# EAGLE design working (EAGLE 8.6.0)
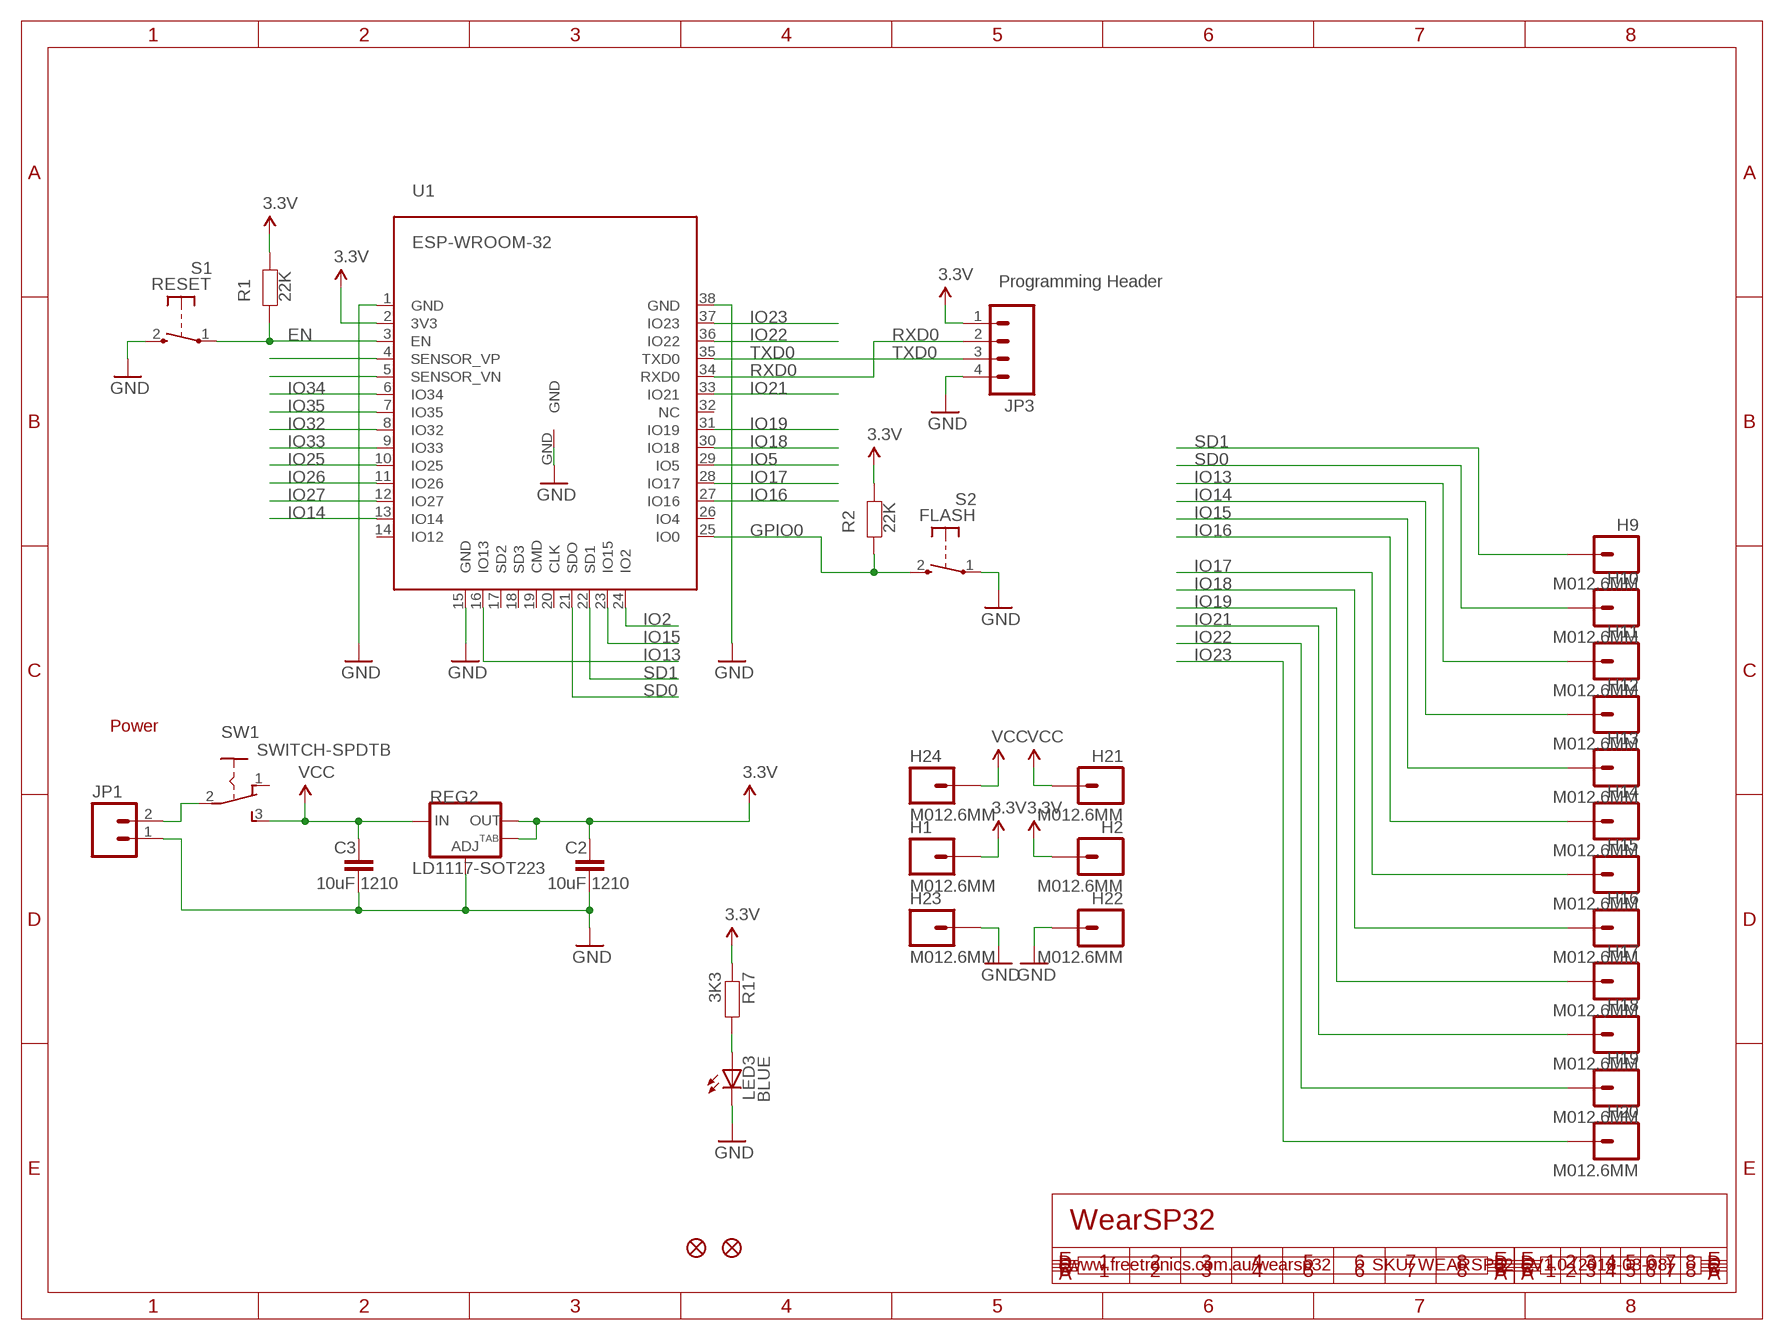
[diagram p0: schematic, sheet 1]

## Parts
C2  10uF 1210  C-EUC1210  [C1210]
C3  10uF 1210  C-EUC1210  [C1210]
H1  M012.6MM  [1X01_2_6MM]
H2  M012.6MM  [1X01_2_6MM]
H9  M012.6MM  [1X01_2_6MM]
H10  M012.6MM  [1X01_2_6MM]
H11  M012.6MM  [1X01_2_6MM]
H12  M012.6MM  [1X01_2_6MM]
H13  M012.6MM  [1X01_2_6MM]
H14  M012.6MM  [1X01_2_6MM]
H15  M012.6MM  [1X01_2_6MM]
H16  M012.6MM  [1X01_2_6MM]
H17  M012.6MM  [1X01_2_6MM]
H18  M012.6MM  [1X01_2_6MM]
H19  M012.6MM  [1X01_2_6MM]
H20  M012.6MM  [1X01_2_6MM]
H21  M012.6MM  [1X01_2_6MM]
H22  M012.6MM  [1X01_2_6MM]
H23  M012.6MM  [1X01_2_6MM]
H24  M012.6MM  [1X01_2_6MM]
JP1  M02JST-PTH-2  [JST-2-PTH]
JP3  M04PTH  [1X04]
LED3  BLUE  LED0603  [LED-0603]
R1  22K  RESISTOR0603  [0603@2]
R2  22K  RESISTOR0603  [0603@2]
R17  3K3  RESISTOR0603  [0603]
REG2  LD1117-SOT223  V_REG_LM1117SOT223  [SOT223]
S1  RESET  TAC_SWITCH_2PIN  [TACTILE_SWITCH_SMD_2PIN_TINY]
S2  FLASH  TAC_SWITCH_2PIN  [TACTILE_SWITCH_SMD_2PIN_TINY]
SW1  SWITCH-SPDTB  [SPDT-2.5MM]
U1  ESP-WROOM-32  [ESP-WROOM-32]
U$4  FIDUCIAL1X2.5  [FIDUCIAL-1X2.5]
U$5  FIDUCIAL1X2.5  [FIDUCIAL-1X2.5]

## Nets
3.3V: C2.1 H1.1 H2.1 JP3.1 R1.1 R2.1 R17.1 REG2.2(OUT) REG2.4(OUT) U1.2(3V3)
EN: R1.2 S1.1(P) U1.3(EN)
GND: C2.2 C3.2 H22.1 H23.1 JP1.1 JP3.4 LED3.C REG2.1(ADJ) S1.2(S) S2.1(P) U1.1(GND) U1.15(GND) U1.38(GND) U1.GND
GPIO0: R2.2 S2.2(S) U1.25(IO0)
IO2: U1.24(IO2)
IO5: U1.29(IO5)
IO13: H11.1 U1.16(IO13)
IO14: H12.1 U1.13(IO14)
IO15: H13.1 U1.23(IO15)
IO16: H14.1 U1.27(IO16)
IO17: H15.1 U1.28(IO17)
IO18: H16.1 U1.30(IO18)
IO19: H17.1 U1.31(IO19)
IO21: H18.1 U1.33(IO21)
IO22: H19.1 U1.36(IO22)
IO23: H20.1 U1.37(IO23)
IO25: U1.10(IO25)
IO26: U1.11(IO26)
IO27: U1.12(IO27)
IO32: U1.8(IO32)
IO33: U1.9(IO33)
IO34: U1.6(IO34)
IO35: U1.7(IO35)
N$1: LED3.A R17.2
N$2: JP1.2 SW1.2
N$20: U1.4(SENSOR_VP)
N$21: U1.5(SENSOR_VN)
RXD0: JP3.2 U1.34(RXD0)
SD0: H10.1 U1.21(SDO)
SD1: H9.1 U1.22(SD1)
TXD0: JP3.3 U1.35(TXD0)
VCC: C3.1 H21.1 H24.1 REG2.3(IN) SW1.3
Unconnected: SW1.1 U1.14(IO12) U1.17(SD2) U1.18(SD3) U1.19(CMD) U1.20(CLK) U1.26(IO4) U1.32(NC)

## Notes on the sheet
- Programming Header
- Power
- WearSP32
- www.freetronics.com.au/wearsp32 | SKU: WEARSP32 | V1.0 (2018-03-08)

## Library data of the parts
C2 C3 = freetronics-jon:C-EU: CAPACITOR, European symbol
H1 H2 H9-H24 = freetronics-jon:M01: Header 1 Standard 1-pin 0.1" header. Use with straight break away headers (SKU : PRT-00116), right angle break away headers (PRT-00553), swiss pins (PRT-00743), machine pins (PRT-00117), and female headers (PRT-00115).
JP1 = freetronics-jon:M02: Header 2 Standard 2-pin 0.1" header. Use with straight break away headers (SKU : PRT-00116), right angle break away headers (PRT-00553), swiss pins (PRT-00743), machine pins (PRT-00117), and female headers (PRT-00115). Molex polarized connector foot print use with SKU : PRT-08233 with associated crimp pins and housings.
JP3 = freetronics-jon:M04: Header 4 Standard 4-pin 0.1" header. Use with straight break away headers (SKU : PRT-00116), right angle break away headers (PRT-00553), swiss pins (PRT-00743), machine pins (PRT-00117), and female headers (PRT-00115). Molex polarized connector foot print use with SKU : PRT-08231 with associated crimp pins and housings. 1MM SMD Version SKU: PRT-10208
LED3 = freetronics-jon:LED: LEDs Standard schematic elements and footprints for 5mm, 3mm, 1206, and 0603 sized LEDs. 5mm - Spark Fun Electronics SKU : COM-00529 (and others)
R1 R2 = freetronics:RESISTOR: Resistor Basic schematic elements and footprints for 0603, 1206, and PTH 1/10th watt (small) resistors.
R17 = freetronics-jon:RESISTOR: Resistor Basic schematic elements and footprints for 0603, 1206, and PTH 1/10th watt (small) resistors.
REG2 = freetronics:V_REG_LM1117: Voltage Regulator LD1117 Adjustable low-dropout voltage regulator available in SOT89 and SOT223 SMT packages.
S1 S2 = freetronics-jon:TAC_SWITCH_2PIN: Momentary Tactile Switch - 2 pin
SW1 = freetronics-jon:SWITCH-SPDT
U1 = esp32:ESP-WROOM-32
U$4 U$5 = freetronics-original:FIDUCIAL: Fiducial Alignment Points Various fiducial points for machine vision alignment.

## Net classes
1 VCC: width 0.305 mm

## Board
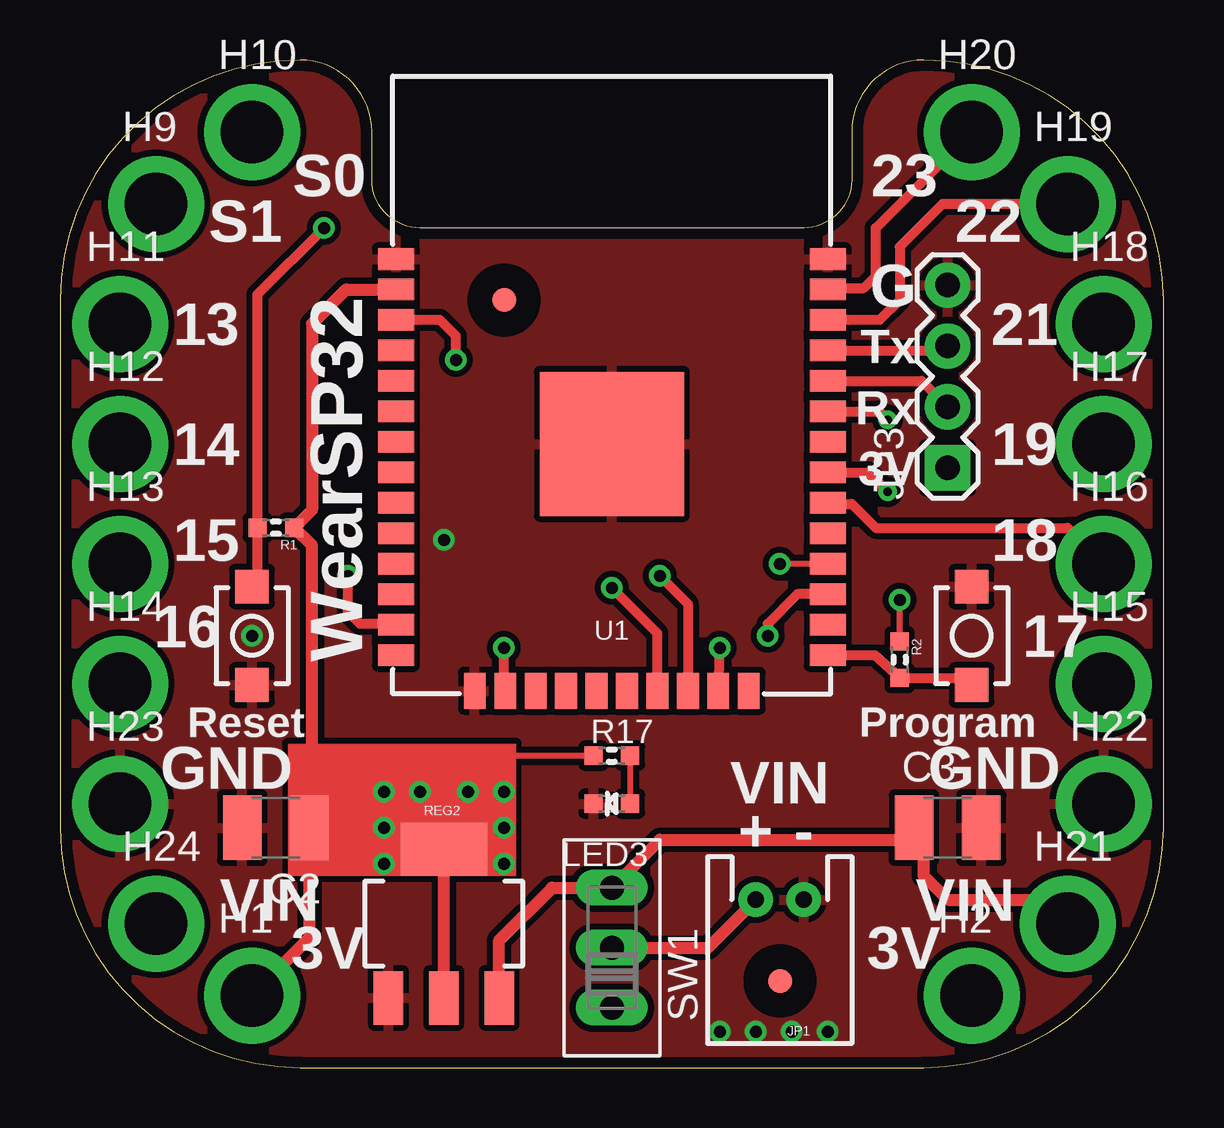
[diagram p1: board, top side]
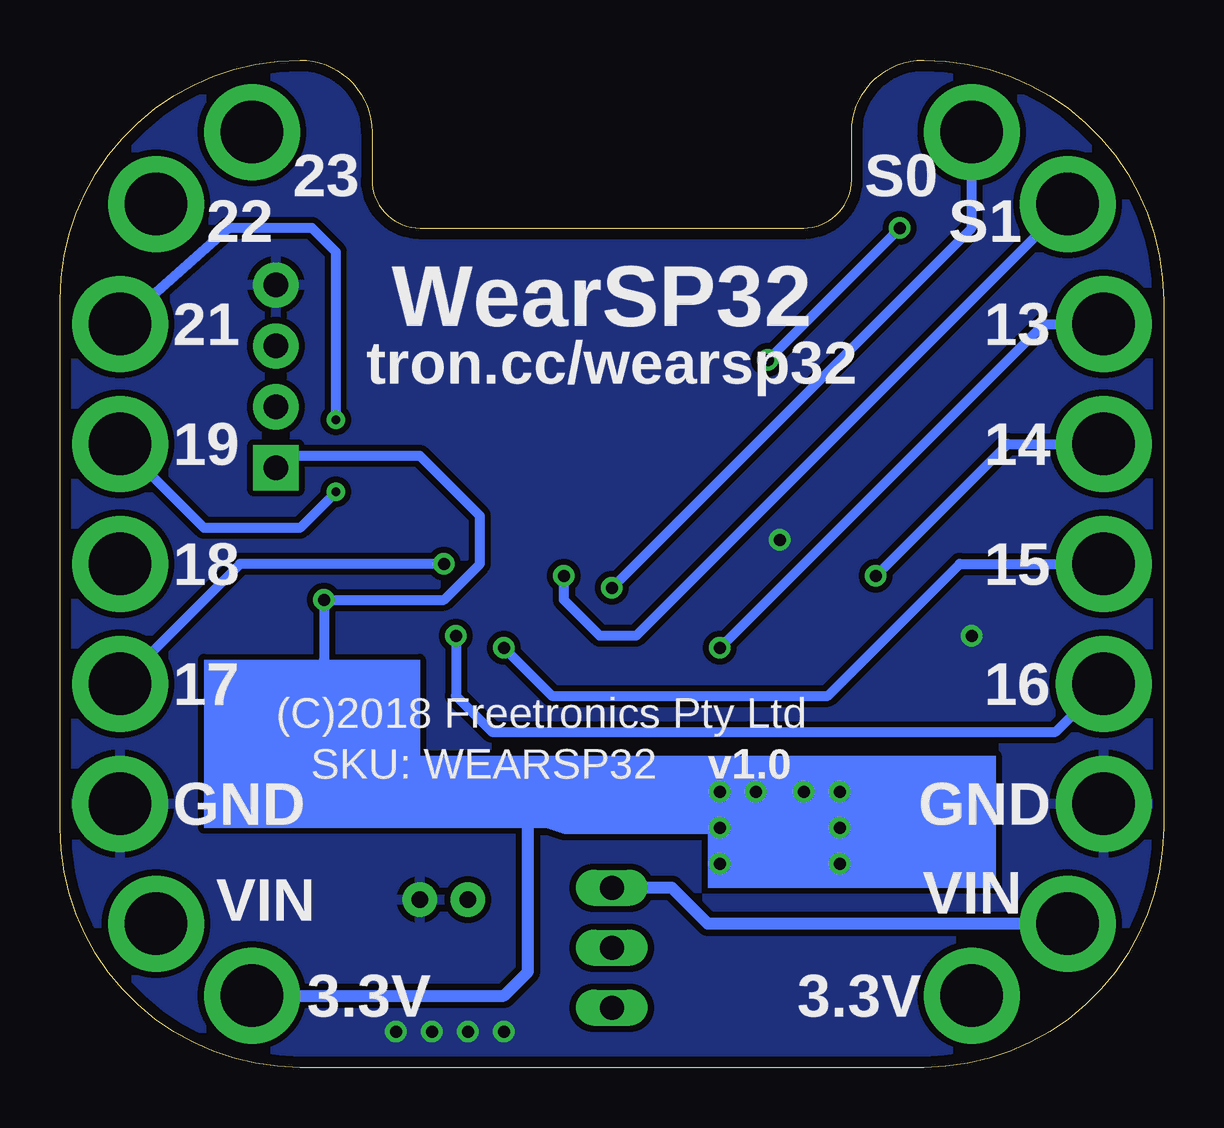
[diagram p2: board, bottom side, seen from below]

Size 46 x 42 mm. Coordinates in mm from the lower left corner, seen from the top.
Outline: 0,10 arc90 10,0 36,0 arc90 46,10 46,32 arc90 36,42 arc90 33,39 33,37 arc-90 31,35 15,35 arc-90 13,37 13,39 arc90 10,42 arc90 0,32 0,10
Copper layers (1*16): Top 0.035mm / dielectric 1.5mm / Bottom 0.035mm
Design rules "default *": minimum track width 10mil, minimum drill 24mil, track to track 10mil, track to pad 10mil, pad to pad 10mil, via to via 10mil, smd to smd 8mil, copper to edge 18mil, drill to drill 8mil, minimum pad ring 10mil, minimum via ring 8mil, stop-mask expansion 4mil, vias tented up to drill 0mil, thermal gap 10mil
tRestrict: area 29,2.6 to 31,4.6; area 17.5,31 to 19.5,33

### Footprints (pad centres in the part's own frame; a part is rotated, then mirrored left to right if it is on the bottom)
C1210 = smd 1.6 x 2.7: 1 -1.4,0; 2 1.4,0
1X01_2_6MM = drill 2.6 pad 4: 1 0,0
JST-2-PTH = drill 0.7 pad 1.448: 1 -1,0; 2 1,0
1X04 = drill 1.016 pad 1.88 square: 1 0,0 | drill 1.016 pad 1.88: 2 2.54,0; 3 5.08,0; 4 7.62,0
LED-0603 = smd 0.762 x 0.762: A -0.762,0; C 0.762,0
0603@2 = smd 0.762 x 0.762: 1 -0.762,0; 2 0.762,0
0603 = smd 0.762 x 0.762: 1 -0.762,0; 2 0.762,0
SOT223 = smd 1.219 x 2.235: 1 -2.311,-3.099; 2 0,-3.099; 3 2.311,-3.099 | smd 3.6 x 2.2: 4 0,3.099
TACTILE_SWITCH_SMD_2PIN_TINY = smd 1.4 x 1.4: 1 -2.05,0; 2 2.05,0
SPDT-2.5MM = drill 1 long: 1 -2.5,0; 2 0,0; 3 2.5,0
ESP-WROOM-32 = smd 0.9 x 1.5: 1 7.7,9; 2 6.43,9; 3 5.16,9; 4 3.89,9; 5 2.62,9; 6 1.35,9; 7 0.08,9; 8 -1.19,9; 9 -2.46,9; 10 -3.73,9; 11 -5,9; 12 -6.27,9; 13 -7.54,9; 14 -8.81,9; 25 -8.81,-9; 26 -7.54,-9; 27 -6.27,-9; 28 -5,-9; 29 -3.73,-9; 30 -2.46,-9; 31 -1.19,-9; 32 0.08,-9; 33 1.35,-9; 34 2.62,-9; 35 3.89,-9; 36 5.16,-9; 37 6.43,-9; 38 7.7,-9 | smd 1.5 x 0.9: 15 -10.3,5.715; 16 -10.3,4.445; 17 -10.3,3.175; 18 -10.3,1.905; 19 -10.3,0.635; 20 -10.3,-0.635; 21 -10.3,-1.905; 22 -10.3,-3.175; 23 -10.3,-4.445; 24 -10.3,-5.715 | smd 6 x 6: GND 0,0
FIDUCIAL-1X2.5 = smd 1 x 1: 1 0,0

### Placement (x,y rotation side)
C2  9,10 180 top
C3  37,10 0 top
H1  8,3 0 top
H2  38,3 0 top
H9  4,36 0 top
H10  8,39 0 top
H11  2.5,31 0 top
H12  2.5,26 0 top
H13  2.5,21 0 top
H14  2.5,16 0 top
H15  43.5,16 0 top
H16  43.5,21 0 top
H17  43.5,26 0 top
H18  43.5,31 0 top
H19  42,36 0 top
H20  38,39 0 top
H21  42,6 0 top
H22  43.5,11 0 top
H23  2.5,11 0 top
H24  4,6 0 top
JP1  30,7 180 top
JP3  37,25 90 top
LED3  23,11 180 top
R1  9,22.5 180 top
R2  35,17 270 top
R17  23,13 0 top
REG2  16,6 0 top
S1  8,18 270 top
S2  38,18 270 top
SW1  23,5 90 top
U1  23,26 90 top
U$4  30.01,3.61 270 top
U$5  18.51,31.99 270 top

### Tracks (layer width: path | path; a pad name or v marks a point on that pad's centre or on a via)
3.3V  (via drill 0.5)
  Top 0.254: R17.1 18.5,13 v18.5,11.5 | R2.1 v35,19.5
  Top 0.508: REG2.2 REG2.4 17.9,9.1 v18.5,8.5 v18.5,10 v18.5,11.5 v17,11.5 v15,11.5 v13.5,11.5 | H1.1 10.4,5.4 C2.1 | C2.1 v13.5,10 | v13.5,10 v13.5,8.5 | v13.5,11.5 v13.5,10 | 10.5,10.1 C2.1 | U1.2 11.93,32.43 10.5,31 10.5,23.24 R1.1 10.5,21.76 10.5,13 v13.5,11.5
  Bottom 0.254: 36.5,25.5 JP3.1 | 35,17 33,11 32.5,10.5 26.5,10.5
  Bottom 0.406: 36.5,25.5 31,25.5 28.5,23 28.5,21 30,19.5 v35,19.5 35,17
  Bottom 0.508: H2.1 27.5,3 26.5,4 26.5,10.5 25,10 v18.5,10
EN  (via drill 0.5)
  Top 0.406: S1.1 8.24,19.81 R1.2 8.24,32.24 v11,35 | v16.5,29.5 16.5,30.5 15.84,31.16 U1.3
  Bottom 0.406: v11,35 v16.5,29.5
GND  (via drill 0.5)
  other vias: 27.5,1.5 29,1.5 30.5,1.5 32,1.5 8,18 16,22
  pour Bottom: 0,10 0,32 arc-90 10,42 arc-90 13,39 13,37 arc90 15,35 31,35 arc90 33,37 33,39 arc-90 36,42 arc-90 46,32 46,10 arc-90 36,0 10,0 arc-90
  pour Top: 0,10 0,32 arc-90 10,42 arc-90 13,39 13,37 arc90 15,35 31,35 arc90 33,37 33,39 arc-90 36,42 arc-90 46,32 46,10 arc-90 36,0 10,0 arc-90
GPIO0
  Top 0.254: 37.71,16.24 S2.2
  Top 0.406: U1.25 33.95,17.19 R2.2 37.71,16.24
IO13  (via drill 0.5)
  Top 0.254: U1.16 18.5,15.76
  Top 0.406: 18.5,15.76 v18.5,17.5
  Bottom 0.406: v18.5,17.5 5,31 H11.1
IO14  (via drill 0.5)
  Top 0.254: U1.13 13.96,18.5
  Top 0.406: 13.96,18.5 12.5,18.5 12,19 v12,20.5
  Bottom 0.406: v12,20.5 6.5,26 H12.1
IO15  (via drill 0.5)
  Top 0.254: U1.23 27.45,15.55
  Top 0.406: 27.45,15.55 v27.5,17.5
  Bottom 0.406: v27.5,17.5 25.5,15.5 14,15.5 8.5,21 H13.1
IO16  (via drill 0.5)
  Top 0.406: U1.27 30.73,19.73 29.5,18.5 v29.5,18
  Bottom 0.406: v29.5,18 29.5,15.5 28,14 4.5,14 H14.1
IO17  (via drill 0.5)
  Top 0.254: U1.28 v30,21
  Bottom 0.406: H15.1 38.5,21 v30,21
IO18
  Top 0.254: U1.30 32.04,23.5
  Top 0.406: 32.04,23.5 33,23.5 34,22.5 42,22.5 H16.1
IO19  (via drill 0.35)
  Top 0.406: U1.31 33.69,24.81 v34.5,24
  Bottom 0.406: v34.5,24 36,22.5 40,22.5 H17.1
IO21  (via drill 0.35)
  Top 0.406: U1.33 34.15,27.35 v34.5,27
  Bottom 0.406: v34.5,27 34.5,34 35.5,35 39,35 H18.1
IO22
  Top 0.406: H19.1 36.79,36 35,34.21 35,32 34.16,31.16 U1.36
IO23
  Top 0.254: U1.37 32.07,32.5
  Top 0.406: H20.1 34,35 34,33 33.5,32.5 32.07,32.5
N$1
  Top 0.254: R17.2 LED3.A
N$2
  Top 0.508: SW1.2 27,5 JP1.2
RXD0
  Top 0.406: U1.34 35.92,28.62 JP3.2
SD0  (via drill 0.5)
  Top 0.406: U1.21 24.91,18.09 v23,20
  Bottom 0.406: v23,20 8,35 H10.1
SD1  (via drill 0.5)
  Top 0.406: v25,20.5 26.18,19.32 U1.22
  Bottom 0.406: H9.1 22,18 23.5,18 25,19.5 v25,20.5
TXD0
  Top 0.254: 36.81,29.89 JP3.3
  Top 0.406: U1.35 36.81,29.89
VCC
  Top 0.508: REG2.3 18.31,5.31 20.5,7.5 SW1.3 25,9.5 35.1,9.5 C3.1 36,9.6 36,8 37,7 41,7 H21.1
  Bottom 0.508: H24.1 19,6 20.5,7.5 SW1.3
(copper drawn outside any net)
  shapes: Bottom area x5, Top area x1

### Text on the board
tPlace: S0 | 23 | S1 | 22 | G | 13 | 21 | Tx | Rx | 14 | 19 | 3V | 15 | 18 | 16 | 17 | WearSP32 | Reset | Program | GND | GND | VIN | + | - | VIN | VIN | 3V | 3V
bPlace: S0 | 23 | S1 | 22 | 13 | WearSP32 | 21 | tron.cc/wearsp32 | 14 | 19 | 15 | 18 | 16 | 17 | (C)2018 Freetronics Pty Ltd | v1.0 | SKU: WEARSP32 | GND | GND | VIN | VIN | 3.3V | 3.3V